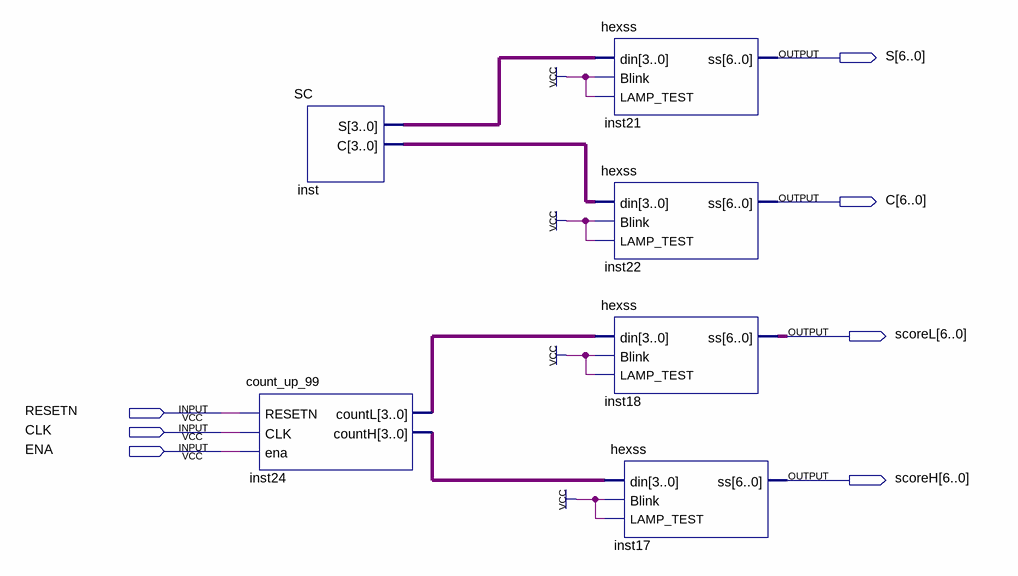
[diagram p0: schematic sheet]
// Quartus schematic score_hexss.bdf as structural Verilog: 6 symbols, 7 pins
module score_hexss (
  input  RESETN,
  input  CLK,
  input  ENA,
  output [6:0] S,
  output [6:0] C,
  output [6:0] scoreL,
  output [6:0] scoreH
);

  wire [3:0] inst24_counth, inst24_countl, inst_c, inst_s;

  count_up_99 inst24 (.RESETN(RESETN), .CLK(CLK), .ena(ENA), .countL(inst24_countl), .countH(inst24_counth));
  SC inst (.S(inst_s), .C(inst_c));
  hexss inst21 (.din(inst_s), .Blink(1'b1), .LAMP_TEST(1'b1), .ss(S));
  hexss inst22 (.din(inst_c), .Blink(1'b1), .LAMP_TEST(1'b1), .ss(C));
  hexss inst18 (.din(inst24_countl), .Blink(1'b1), .LAMP_TEST(1'b1), .ss(scoreL));
  hexss inst17 (.din(inst24_counth), .Blink(1'b1), .LAMP_TEST(1'b1), .ss(scoreH));
endmodule
